# Altium schematic sheet Main.SchDoc
size A4
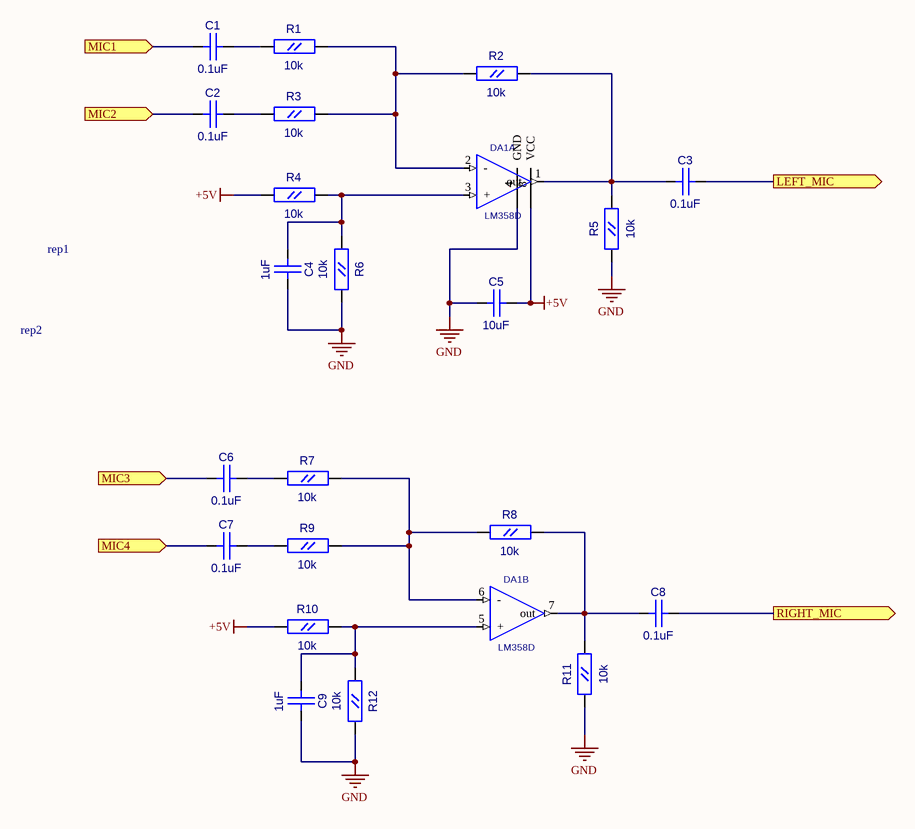
[diagram p0: Main.SchDoc]

## Parts
C1  0.1uF  [CC0603]
C2  0.1uF  [CC0603]
C3  0.1uF  [CC0603]
C4  1uF  [CC0603]
C5  10uF  [CC0805]
C6  0.1uF  [CC0603]
C7  0.1uF  [CC0603]
C8  0.1uF  [CC0603]
C9  1uF  [CC0603]
DA1  LM358D  [SO-8]  (parts A,B of 2)
R1  10k  [RC0603]
R2  10k  [RC0603]
R3  10k  [RC0603]
R4  10k  [RC0603]
R5  10k  [RC0603]
R6  10k  [RC0603]
R7  10k  [RC0603]
R8  10k  [RC0603]
R9  10k  [RC0603]
R10  10k  [RC0603]
R11  10k  [RC0603]
R12  10k  [RC0603]
rep1  REPER1.2  [REPER1.2]  (value not drawn)
rep2  REPER1.2  [REPER1.2]  (value not drawn)

## Ports
LEFT_MIC (out), MIC1 (in), MIC2 (in), MIC3 (in), MIC4 (in), RIGHT_MIC (out)

## Nets
+5V: C5.2(B) DA1.8(VCC) R4.1(A) R10.1(A)
GND: C4.2(B) C5.1(A) C9.2(B) DA1.4(GND) R5.1(A) R6.2(B) R11.1(A) R12.2(B)
LEFT_MIC: C3.2(B) ; port LEFT_MIC
MIC1: C1.1(A) ; port MIC1
MIC2: C2.1(A) ; port MIC2
MIC3: C6.1(A) ; port MIC3
MIC4: C7.1(A) ; port MIC4
RIGHT_MIC: C8.2(B) ; port RIGHT_MIC
NetC1_2: C1.2(B) R1.1(A)
NetC2_2: C2.2(B) R3.1(A)
NetC3_1: C3.1(A) DA1.1(out) R2.2(B) R5.2(B)
NetC4_1: C4.1(A) DA1.3(+) R4.2(B) R6.1(A)
NetC6_2: C6.2(B) R7.1(A)
NetC7_2: C7.2(B) R9.1(A)
NetC8_1: C8.1(A) DA1.7(out) R8.2(B) R11.2(B)
NetC9_1: C9.1(A) DA1.5(+) R10.2(B) R12.1(A)
NetDA1_2: DA1.2(-) R1.2(B) R2.1(A) R3.2(B)
NetDA1_6: DA1.6(-) R7.2(B) R8.1(A) R9.2(B)

Not connected (* = marked no-connect by the designer): rep1 1; rep2 1

## Library data of the parts
C1-C4 C6-C9 = CC0603
  C1-C3 C6-C8: Value: 0.1uF
  C4 C9: Value: 1uF
C5 = CC0805: Value: 10uF
R1-R12 = RC0603: Value: 10k
DA1 = LM358D: Value: *
rep1 rep2 = REPER1.2: Value: *